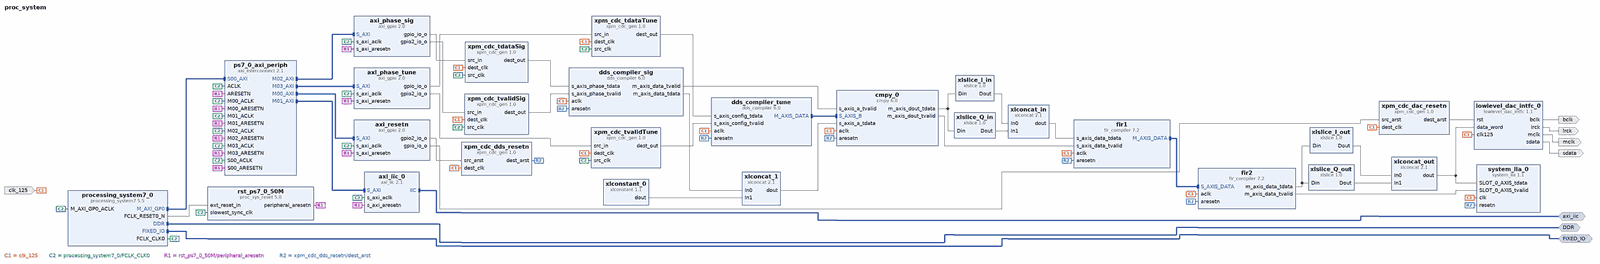
[diagram p0: block diagram of the top level, whole]
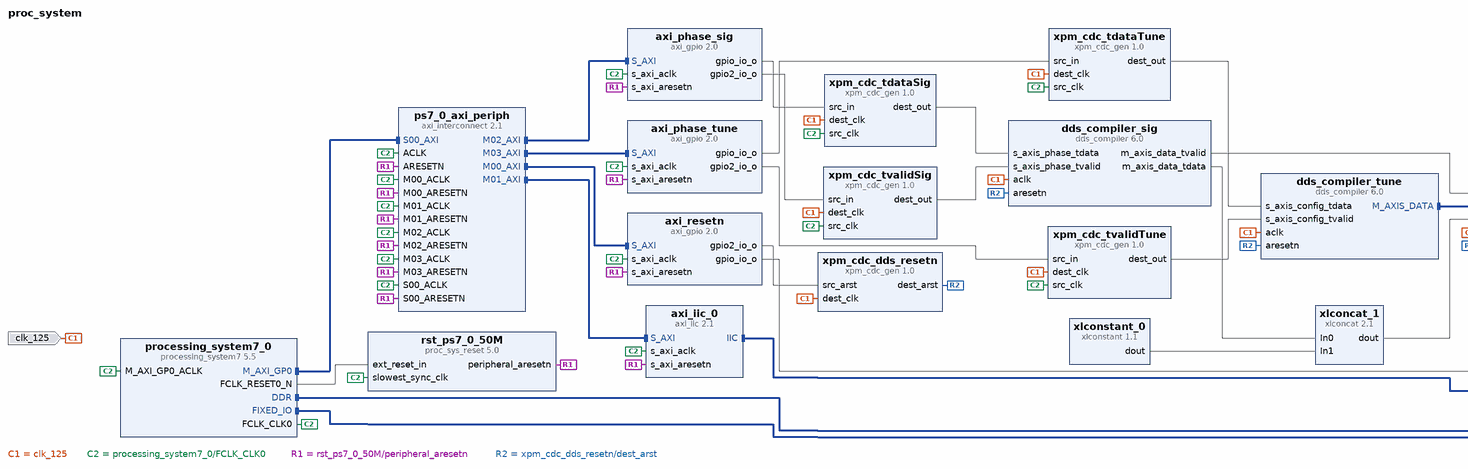
[diagram p1: block diagram of the top level, left part]
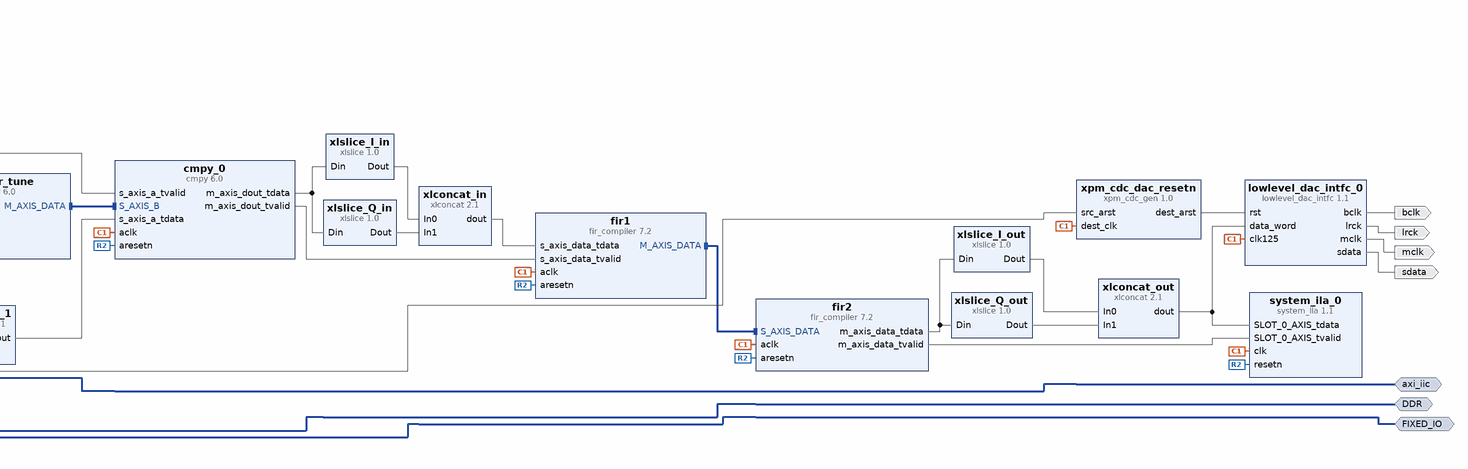
[diagram p2: block diagram of the top level, right part]
# Vivado block design proc_system, xc7z020clg400-1, Vivado 2022.1
create_bd_design proc_system

create_bd_intf_port -mode Master -vlnv xilinx.com:interface:ddrx_rtl:1.0 DDR
create_bd_intf_port -mode Master -vlnv xilinx.com:display_processing_system7:fixedio_rtl:1.0 FIXED_IO
create_bd_intf_port -mode Master -vlnv xilinx.com:interface:iic_rtl:1.0 axi_iic
create_bd_port -dir I -type clk clk_125
set_property -dict {CONFIG.FREQ_HZ 125000000} [get_bd_ports clk_125]
create_bd_port -dir O sdata
create_bd_port -dir O bclk
create_bd_port -dir O lrck
create_bd_port -dir O mclk

create_bd_cell -type ip -vlnv xilinx.com:ip:axi_iic:2.1 axi_iic_0
set_property -dict {CONFIG.IIC_BOARD_INTERFACE hdmi_in_ddc CONFIG.USE_BOARD_FLOW true} [get_bd_cells axi_iic_0]
create_bd_cell -type ip -vlnv xilinx.com:ip:processing_system7:5.5 processing_system7_0
set_property -dict [list \
  CONFIG.PCW_APU_PERIPHERAL_FREQMHZ 667 \
  CONFIG.PCW_ENET0_ENET0_IO {MIO 16 .. 27} \
  CONFIG.PCW_ENET0_GRP_MDIO_ENABLE 1 \
  CONFIG.PCW_ENET0_GRP_MDIO_IO {MIO 52 .. 53} \
  CONFIG.PCW_ENET0_PERIPHERAL_ENABLE 1 \
  CONFIG.PCW_ENET0_RESET_ENABLE 0 \
  CONFIG.PCW_ENET_RESET_ENABLE 1 \
  CONFIG.PCW_ENET_RESET_SELECT {Share reset pin} \
  CONFIG.PCW_FPGA0_PERIPHERAL_FREQMHZ 125 \
  CONFIG.PCW_GPIO_MIO_GPIO_ENABLE 1 \
  CONFIG.PCW_GPIO_MIO_GPIO_IO MIO \
  CONFIG.PCW_I2C_RESET_ENABLE 0 \
  CONFIG.PCW_PRESET_BANK1_VOLTAGE {LVCMOS 1.8V} \
  CONFIG.PCW_QSPI_GRP_FBCLK_ENABLE 1 \
  CONFIG.PCW_QSPI_GRP_FBCLK_IO {MIO 8} \
  CONFIG.PCW_QSPI_GRP_SINGLE_SS_ENABLE 1 \
  CONFIG.PCW_QSPI_GRP_SINGLE_SS_IO {MIO 1 .. 6} \
  CONFIG.PCW_QSPI_PERIPHERAL_ENABLE 1 \
  CONFIG.PCW_QSPI_QSPI_IO {MIO 1 .. 6} \
  CONFIG.PCW_SD0_GRP_CD_ENABLE 1 \
  CONFIG.PCW_SD0_GRP_CD_IO {MIO 47} \
  CONFIG.PCW_SD0_GRP_WP_ENABLE 0 \
  CONFIG.PCW_SD0_PERIPHERAL_ENABLE 1 \
  CONFIG.PCW_SD0_SD0_IO {MIO 40 .. 45} \
  CONFIG.PCW_SDIO_PERIPHERAL_FREQMHZ 50 \
  CONFIG.PCW_SINGLE_QSPI_DATA_MODE x4 \
  CONFIG.PCW_UART1_PERIPHERAL_ENABLE 1 \
  CONFIG.PCW_UART1_UART1_IO {MIO 48 .. 49} \
  CONFIG.PCW_UART_PERIPHERAL_FREQMHZ 100 \
  CONFIG.PCW_UIPARAM_DDR_FREQ_MHZ 533.333333 \
  CONFIG.PCW_UIPARAM_DDR_MEMORY_TYPE {DDR 3 (Low Voltage)} \
  CONFIG.PCW_UIPARAM_DDR_PARTNO {MT41K256M16 RE-125} \
  CONFIG.PCW_UIPARAM_GENERATE_SUMMARY NONE \
  CONFIG.PCW_USB0_PERIPHERAL_ENABLE 1 \
  CONFIG.PCW_USB0_RESET_ENABLE 1 \
  CONFIG.PCW_USB0_RESET_IO {MIO 46} \
  CONFIG.PCW_USB0_USB0_IO {MIO 28 .. 39} \
  CONFIG.PCW_USB_RESET_ENABLE 1 \
  CONFIG.PCW_USB_RESET_SELECT {Share reset pin} \
] [get_bd_cells processing_system7_0]
# 296 more settings of processing_system7_0 are not shown: defaults, MIO pin electricals, DDR timing, and values the tool derives
create_bd_cell -type ip -vlnv xilinx.com:ip:axi_interconnect:2.1 ps7_0_axi_periph
set_property -dict {CONFIG.NUM_MI 4} [get_bd_cells ps7_0_axi_periph]
create_bd_cell -type ip -vlnv xilinx.com:ip:axi_gpio:2.0 axi_resetn
set_property -dict [list \
  CONFIG.C_ALL_INPUTS 0 \
  CONFIG.C_ALL_OUTPUTS 1 \
  CONFIG.C_ALL_OUTPUTS_2 1 \
  CONFIG.C_DOUT_DEFAULT_2 0x00000001 \
  CONFIG.C_GPIO2_WIDTH 1 \
  CONFIG.C_GPIO_WIDTH 1 \
  CONFIG.C_IS_DUAL 1 \
  CONFIG.GPIO2_BOARD_INTERFACE Custom \
  CONFIG.GPIO_BOARD_INTERFACE Custom \
  CONFIG.USE_BOARD_FLOW true \
] [get_bd_cells axi_resetn]
create_bd_cell -type ip -vlnv xilinx.com:ip:proc_sys_reset:5.0 rst_ps7_0_50M
create_bd_cell -type ip -vlnv xilinx.com:ip:dds_compiler:6.0 dds_compiler_sig
set_property -dict [list \
  CONFIG.Amplitude_Mode Unit_Circle \
  CONFIG.DATA_Has_TLAST Not_Required \
  CONFIG.DDS_Clock_Rate 125 \
  CONFIG.Frequency_Resolution 0.4 \
  CONFIG.Has_ARESETn true \
  CONFIG.Has_Phase_Out false \
  CONFIG.Latency 8 \
  CONFIG.M_DATA_Has_TUSER Not_Required \
  CONFIG.Noise_Shaping Taylor_Series_Corrected \
  CONFIG.Output_Frequency1 0 \
  CONFIG.Output_Selection Cosine \
  CONFIG.Output_Width 16 \
  CONFIG.PINC1 0 \
  CONFIG.Parameter_Entry Hardware_Parameters \
  CONFIG.Phase_Increment Streaming \
  CONFIG.Phase_Width 27 \
  CONFIG.S_PHASE_Has_TUSER Not_Required \
] [get_bd_cells dds_compiler_sig]
create_bd_cell -type ip -vlnv xilinx.com:ip:axi_gpio:2.0 axi_phase_sig
set_property -dict [list \
  CONFIG.C_ALL_INPUTS_2 0 \
  CONFIG.C_ALL_OUTPUTS 1 \
  CONFIG.C_ALL_OUTPUTS_2 1 \
  CONFIG.C_GPIO2_WIDTH 1 \
  CONFIG.C_IS_DUAL 1 \
  CONFIG.GPIO2_BOARD_INTERFACE Custom \
] [get_bd_cells axi_phase_sig]
create_bd_cell -type ip -vlnv xilinx.com:ip:system_ila:1.1 system_ila_0
set_property -dict [list \
  CONFIG.ALL_PROBE_SAME_MU_CNT 2 \
  CONFIG.C_DATA_DEPTH 2048 \
  CONFIG.C_EN_STRG_QUAL 1 \
  CONFIG.C_NUM_MONITOR_SLOTS 1 \
  CONFIG.C_PROBE0_MU_CNT 2 \
  CONFIG.C_SLOT 0 \
  CONFIG.C_SLOT_0_APC_EN 0 \
  CONFIG.C_SLOT_0_INTF_TYPE xilinx.com:interface:axis_rtl:1.0 \
  CONFIG.C_SLOT_1_AXIS_TDATA_WIDTH 16 \
  CONFIG.C_SLOT_1_INTF_TYPE xilinx.com:interface:axis_rtl:1.0 \
] [get_bd_cells system_ila_0]
create_bd_cell -type ip -vlnv xilinx.com:ip:xpm_cdc_gen:1.0 xpm_cdc_tvalidSig
set_property -dict {CONFIG.WIDTH 1} [get_bd_cells xpm_cdc_tvalidSig]
create_bd_cell -type ip -vlnv xilinx.com:ip:xpm_cdc_gen:1.0 xpm_cdc_dac_resetn
set_property -dict {CONFIG.CDC_TYPE xpm_cdc_async_rst CONFIG.WIDTH 1} [get_bd_cells xpm_cdc_dac_resetn]
create_bd_cell -type ip -vlnv xilinx.com:ip:xpm_cdc_gen:1.0 xpm_cdc_dds_resetn
set_property -dict {CONFIG.CDC_TYPE xpm_cdc_async_rst} [get_bd_cells xpm_cdc_dds_resetn]
create_bd_cell -type ip -vlnv xilinx.com:ip:xpm_cdc_gen:1.0 xpm_cdc_tdataSig
set_property -dict {CONFIG.WIDTH 32} [get_bd_cells xpm_cdc_tdataSig]
create_bd_cell -type ip -vlnv xilinx.com:ip:fir_compiler:7.2 fir1
set_property -dict [list \
  CONFIG.BestPrecision false \
  CONFIG.Clock_Frequency 125 \
  CONFIG.CoefficientSource COE_File \
  CONFIG.Coefficient_File ../../../../../../../../../Module4/Lab4_analysis/filter1.coe \
  CONFIG.Coefficient_Fractional_Bits 15 \
  CONFIG.Coefficient_Sets 1 \
  CONFIG.Coefficient_Sign Signed \
  CONFIG.Coefficient_Structure Inferred \
  CONFIG.Coefficient_Width 18 \
  CONFIG.ColumnConfig 3 \
  CONFIG.Decimation_Rate 40 \
  CONFIG.Filter_Architecture Systolic_Multiply_Accumulate \
  CONFIG.Filter_Type Decimation \
  CONFIG.Has_ARESETn true \
  CONFIG.Interpolation_Rate 1 \
  CONFIG.Number_Channels 1 \
  CONFIG.Number_Paths 2 \
  CONFIG.Output_Rounding_Mode Truncate_LSBs \
  CONFIG.Output_Width 17 \
  CONFIG.Quantization Quantize_Only \
  CONFIG.RateSpecification Frequency_Specification \
  CONFIG.Rate_Change_Type Integer \
  CONFIG.Sample_Frequency 125 \
  CONFIG.Zero_Pack_Factor 1 \
] [get_bd_cells fir1]
create_bd_cell -type ip -vlnv xilinx.com:ip:fir_compiler:7.2 fir2
set_property -dict [list \
  CONFIG.Clock_Frequency 125 \
  CONFIG.CoefficientSource COE_File \
  CONFIG.Coefficient_File ../../../../../../../../../Module4/Lab4_analysis/filter2.coe \
  CONFIG.Coefficient_Fractional_Bits 15 \
  CONFIG.Coefficient_Sets 1 \
  CONFIG.Coefficient_Sign Signed \
  CONFIG.Coefficient_Structure Inferred \
  CONFIG.Coefficient_Width 18 \
  CONFIG.Decimation_Rate 64 \
  CONFIG.Filter_Architecture Systolic_Multiply_Accumulate \
  CONFIG.Filter_Type Decimation \
  CONFIG.Has_ARESETn true \
  CONFIG.Interpolation_Rate 1 \
  CONFIG.Number_Channels 1 \
  CONFIG.Number_Paths 2 \
  CONFIG.Output_Rounding_Mode Truncate_LSBs \
  CONFIG.Output_Width 18 \
  CONFIG.Quantization Quantize_Only \
  CONFIG.RateSpecification Frequency_Specification \
  CONFIG.Sample_Frequency 3.125 \
  CONFIG.Zero_Pack_Factor 1 \
] [get_bd_cells fir2]
create_bd_cell -type ip -vlnv xilinx.com:ip:xlslice:1.0 xlslice_I_out
set_property -dict {CONFIG.DIN_FROM 15 CONFIG.DIN_WIDTH 48 CONFIG.DOUT_WIDTH 16} [get_bd_cells xlslice_I_out]
create_bd_cell -type ip -vlnv xilinx.com:ip:dds_compiler:6.0 dds_compiler_tune
set_property -dict [list \
  CONFIG.Amplitude_Mode Unit_Circle \
  CONFIG.DATA_Has_TLAST Not_Required \
  CONFIG.DDS_Clock_Rate 125 \
  CONFIG.Has_ARESETn true \
  CONFIG.Has_Phase_Out false \
  CONFIG.Latency 8 \
  CONFIG.M_DATA_Has_TUSER Not_Required \
  CONFIG.Noise_Shaping Taylor_Series_Corrected \
  CONFIG.Output_Frequency1 0 \
  CONFIG.Output_Width 16 \
  CONFIG.Parameter_Entry Hardware_Parameters \
  CONFIG.Phase_Increment Programmable \
  CONFIG.Phase_Width 27 \
  CONFIG.Phase_offset None \
  CONFIG.S_PHASE_Has_TUSER Not_Required \
] [get_bd_cells dds_compiler_tune]
create_bd_cell -type ip -vlnv xilinx.com:ip:axi_gpio:2.0 axi_phase_tune
set_property -dict [list \
  CONFIG.C_ALL_INPUTS 0 \
  CONFIG.C_ALL_INPUTS_2 0 \
  CONFIG.C_ALL_OUTPUTS 1 \
  CONFIG.C_ALL_OUTPUTS_2 1 \
  CONFIG.C_GPIO2_WIDTH 1 \
  CONFIG.C_GPIO_WIDTH 32 \
  CONFIG.C_IS_DUAL 1 \
  CONFIG.GPIO2_BOARD_INTERFACE Custom \
  CONFIG.GPIO_BOARD_INTERFACE Custom \
  CONFIG.USE_BOARD_FLOW true \
] [get_bd_cells axi_phase_tune]
create_bd_cell -type ip -vlnv xilinx.com:ip:xpm_cdc_gen:1.0 xpm_cdc_tdataTune
set_property -dict {CONFIG.WIDTH 32} [get_bd_cells xpm_cdc_tdataTune]
create_bd_cell -type ip -vlnv xilinx.com:ip:xpm_cdc_gen:1.0 xpm_cdc_tvalidTune
set_property -dict {CONFIG.WIDTH 1} [get_bd_cells xpm_cdc_tvalidTune]
create_bd_cell -type ip -vlnv jhuapl.edu:user:lowlevel_dac_intfc:1.1 lowlevel_dac_intfc_0
create_bd_cell -type ip -vlnv xilinx.com:ip:cmpy:6.0 cmpy_0
set_property -dict [list \
  CONFIG.APortWidth 16 \
  CONFIG.ARESETN true \
  CONFIG.BPortWidth 16 \
  CONFIG.MinimumLatency 6 \
  CONFIG.OutputWidth 19 \
  CONFIG.RoundMode Truncate \
] [get_bd_cells cmpy_0]
create_bd_cell -type ip -vlnv xilinx.com:ip:xlslice:1.0 xlslice_Q_out
set_property -dict {CONFIG.DIN_FROM 39 CONFIG.DIN_TO 24 CONFIG.DIN_WIDTH 48 CONFIG.DOUT_WIDTH 16} [get_bd_cells xlslice_Q_out]
create_bd_cell -type ip -vlnv xilinx.com:ip:xlconcat:2.1 xlconcat_out
create_bd_cell -type ip -vlnv xilinx.com:ip:xlconcat:2.1 xlconcat_1
create_bd_cell -type ip -vlnv xilinx.com:ip:xlconstant:1.1 xlconstant_0
set_property -dict {CONFIG.CONST_VAL 0 CONFIG.CONST_WIDTH 16} [get_bd_cells xlconstant_0]
create_bd_cell -type ip -vlnv xilinx.com:ip:xlslice:1.0 xlslice_I_in
set_property -dict {CONFIG.DIN_FROM 15 CONFIG.DIN_WIDTH 48 CONFIG.DOUT_WIDTH 16} [get_bd_cells xlslice_I_in]
create_bd_cell -type ip -vlnv xilinx.com:ip:xlslice:1.0 xlslice_Q_in
set_property -dict {CONFIG.DIN_FROM 39 CONFIG.DIN_TO 24 CONFIG.DIN_WIDTH 48 CONFIG.DOUT_WIDTH 16} [get_bd_cells xlslice_Q_in]
create_bd_cell -type ip -vlnv xilinx.com:ip:xlconcat:2.1 xlconcat_in

# ---- connections ----

connect_bd_intf_net [get_bd_intf_ports axi_iic] [get_bd_intf_pins axi_iic_0/IIC]
connect_bd_intf_net [get_bd_intf_pins dds_compiler_tune/M_AXIS_DATA] [get_bd_intf_pins cmpy_0/S_AXIS_B]
connect_bd_intf_net [get_bd_intf_pins fir1/M_AXIS_DATA] [get_bd_intf_pins fir2/S_AXIS_DATA]
connect_bd_intf_net [get_bd_intf_ports DDR] [get_bd_intf_pins processing_system7_0/DDR]
connect_bd_intf_net [get_bd_intf_ports FIXED_IO] [get_bd_intf_pins processing_system7_0/FIXED_IO]
connect_bd_intf_net [get_bd_intf_pins processing_system7_0/M_AXI_GP0] [get_bd_intf_pins ps7_0_axi_periph/S00_AXI]
connect_bd_intf_net [get_bd_intf_pins ps7_0_axi_periph/M00_AXI] [get_bd_intf_pins axi_resetn/S_AXI]
connect_bd_intf_net [get_bd_intf_pins axi_iic_0/S_AXI] [get_bd_intf_pins ps7_0_axi_periph/M01_AXI]
connect_bd_intf_net [get_bd_intf_pins ps7_0_axi_periph/M02_AXI] [get_bd_intf_pins axi_phase_sig/S_AXI]
connect_bd_intf_net [get_bd_intf_pins ps7_0_axi_periph/M03_AXI] [get_bd_intf_pins axi_phase_tune/S_AXI]
connect_bd_net -net axi_phaseTune_gpio2_io_o [get_bd_pins axi_phase_tune/gpio2_io_o] [get_bd_pins xpm_cdc_tvalidTune/src_in]
connect_bd_net -net axi_phaseTune_gpio_io_o [get_bd_pins axi_phase_tune/gpio_io_o] [get_bd_pins xpm_cdc_tdataTune/src_in]
connect_bd_net -net axi_phase_gpio2_io_o [get_bd_pins axi_phase_sig/gpio2_io_o] [get_bd_pins xpm_cdc_tvalidSig/src_in]
connect_bd_net -net axi_phase_gpio_io_o [get_bd_pins axi_phase_sig/gpio_io_o] [get_bd_pins xpm_cdc_tdataSig/src_in]
connect_bd_net [get_bd_pins axi_resetn/gpio2_io_o] [get_bd_pins xpm_cdc_dds_resetn/src_arst]
connect_bd_net [get_bd_pins axi_resetn/gpio_io_o] [get_bd_pins xpm_cdc_dac_resetn/src_arst]
connect_bd_net [get_bd_ports clk_125] \
  [get_bd_pins dds_compiler_sig/aclk] [get_bd_pins system_ila_0/clk] [get_bd_pins xpm_cdc_tvalidSig/dest_clk] \
  [get_bd_pins xpm_cdc_dac_resetn/dest_clk] [get_bd_pins xpm_cdc_dds_resetn/dest_clk] [get_bd_pins xpm_cdc_tdataSig/dest_clk] \
  [get_bd_pins fir1/aclk] [get_bd_pins fir2/aclk] [get_bd_pins xpm_cdc_tvalidTune/dest_clk] \
  [get_bd_pins xpm_cdc_tdataTune/dest_clk] [get_bd_pins dds_compiler_tune/aclk] [get_bd_pins cmpy_0/aclk] \
  [get_bd_pins lowlevel_dac_intfc_0/clk125]
connect_bd_net [get_bd_pins cmpy_0/m_axis_dout_tdata] [get_bd_pins xlslice_I_in/Din] [get_bd_pins xlslice_Q_in/Din]
connect_bd_net [get_bd_pins cmpy_0/m_axis_dout_tvalid] [get_bd_pins fir1/s_axis_data_tvalid]
connect_bd_net [get_bd_pins dds_compiler_sig/m_axis_data_tdata] [get_bd_pins xlconcat_1/In0]
connect_bd_net [get_bd_pins dds_compiler_sig/m_axis_data_tvalid] [get_bd_pins cmpy_0/s_axis_a_tvalid]
connect_bd_net [get_bd_pins fir2/m_axis_data_tdata] [get_bd_pins xlslice_I_out/Din] [get_bd_pins xlslice_Q_out/Din]
connect_bd_net [get_bd_pins fir2/m_axis_data_tvalid] [get_bd_pins system_ila_0/SLOT_0_AXIS_tvalid]
connect_bd_net [get_bd_pins lowlevel_dac_intfc_0/bclk] [get_bd_ports bclk]
connect_bd_net [get_bd_pins lowlevel_dac_intfc_0/lrck] [get_bd_ports lrck]
connect_bd_net [get_bd_pins lowlevel_dac_intfc_0/mclk] [get_bd_ports mclk]
connect_bd_net [get_bd_pins lowlevel_dac_intfc_0/sdata] [get_bd_ports sdata]
connect_bd_net [get_bd_pins processing_system7_0/FCLK_CLK0] \
  [get_bd_pins axi_iic_0/s_axi_aclk] [get_bd_pins processing_system7_0/M_AXI_GP0_ACLK] [get_bd_pins ps7_0_axi_periph/ACLK] \
  [get_bd_pins ps7_0_axi_periph/M00_ACLK] [get_bd_pins ps7_0_axi_periph/M01_ACLK] [get_bd_pins ps7_0_axi_periph/M02_ACLK] \
  [get_bd_pins ps7_0_axi_periph/S00_ACLK] [get_bd_pins axi_resetn/s_axi_aclk] [get_bd_pins rst_ps7_0_50M/slowest_sync_clk] \
  [get_bd_pins axi_phase_sig/s_axi_aclk] [get_bd_pins xpm_cdc_tvalidSig/src_clk] [get_bd_pins xpm_cdc_tdataSig/src_clk] \
  [get_bd_pins axi_phase_tune/s_axi_aclk] [get_bd_pins xpm_cdc_tdataTune/src_clk] [get_bd_pins xpm_cdc_tvalidTune/src_clk] \
  [get_bd_pins ps7_0_axi_periph/M03_ACLK]
connect_bd_net [get_bd_pins processing_system7_0/FCLK_RESET0_N] [get_bd_pins rst_ps7_0_50M/ext_reset_in]
connect_bd_net [get_bd_pins rst_ps7_0_50M/peripheral_aresetn] \
  [get_bd_pins axi_iic_0/s_axi_aresetn] [get_bd_pins ps7_0_axi_periph/ARESETN] [get_bd_pins ps7_0_axi_periph/M00_ARESETN] \
  [get_bd_pins ps7_0_axi_periph/M01_ARESETN] [get_bd_pins ps7_0_axi_periph/M02_ARESETN] \
  [get_bd_pins ps7_0_axi_periph/S00_ARESETN] [get_bd_pins axi_resetn/s_axi_aresetn] [get_bd_pins axi_phase_sig/s_axi_aresetn] \
  [get_bd_pins axi_phase_tune/s_axi_aresetn] [get_bd_pins ps7_0_axi_periph/M03_ARESETN]
connect_bd_net -net xlconcat_0_dout [get_bd_pins xlconcat_out/dout] \
  [get_bd_pins lowlevel_dac_intfc_0/data_word] [get_bd_pins system_ila_0/SLOT_0_AXIS_tdata]
connect_bd_net [get_bd_pins xlconcat_1/dout] [get_bd_pins cmpy_0/s_axis_a_tdata]
connect_bd_net -net xlconcat_2_dout [get_bd_pins xlconcat_in/dout] [get_bd_pins fir1/s_axis_data_tdata]
connect_bd_net [get_bd_pins xlconstant_0/dout] [get_bd_pins xlconcat_1/In1]
connect_bd_net -net xlslice_0_Dout [get_bd_pins xlslice_I_out/Dout] [get_bd_pins xlconcat_out/In0]
connect_bd_net -net xlslice_1_Dout [get_bd_pins xlslice_Q_out/Dout] [get_bd_pins xlconcat_out/In1]
connect_bd_net [get_bd_pins xlslice_I_in/Dout] [get_bd_pins xlconcat_in/In0]
connect_bd_net [get_bd_pins xlslice_Q_in/Dout] [get_bd_pins xlconcat_in/In1]
connect_bd_net [get_bd_pins xpm_cdc_dac_resetn/dest_arst] [get_bd_pins lowlevel_dac_intfc_0/rst]
connect_bd_net -net xpm_cdc_gen_0_dest_arst [get_bd_pins xpm_cdc_dds_resetn/dest_arst] \
  [get_bd_pins dds_compiler_sig/aresetn] [get_bd_pins system_ila_0/resetn] [get_bd_pins fir1/aresetn] \
  [get_bd_pins fir2/aresetn] [get_bd_pins dds_compiler_tune/aresetn] [get_bd_pins cmpy_0/aresetn]
connect_bd_net [get_bd_pins xpm_cdc_tdataTune/dest_out] [get_bd_pins dds_compiler_tune/s_axis_config_tdata]
connect_bd_net -net xpm_cdc_tdata_dest_out [get_bd_pins xpm_cdc_tdataSig/dest_out] [get_bd_pins dds_compiler_sig/s_axis_phase_tdata]
connect_bd_net [get_bd_pins xpm_cdc_tvalidTune/dest_out] [get_bd_pins dds_compiler_tune/s_axis_config_tvalid]
connect_bd_net -net xpm_cdc_tvalid_dest_out [get_bd_pins xpm_cdc_tvalidSig/dest_out] [get_bd_pins dds_compiler_sig/s_axis_phase_tvalid]

# ---- address map ----
assign_bd_address -offset 0x41200000 -range 64K -target_address_space [get_bd_addr_spaces processing_system7_0/Data] [get_bd_addr_segs axi_resetn/S_AXI/Reg]
assign_bd_address -offset 0x41210000 -range 64K -target_address_space [get_bd_addr_spaces processing_system7_0/Data] [get_bd_addr_segs axi_phase_sig/S_AXI/Reg]
assign_bd_address -offset 0x41220000 -range 64K -target_address_space [get_bd_addr_spaces processing_system7_0/Data] [get_bd_addr_segs axi_phase_tune/S_AXI/Reg]
assign_bd_address -offset 0x41600000 -range 64K -target_address_space [get_bd_addr_spaces processing_system7_0/Data] [get_bd_addr_segs axi_iic_0/S_AXI/Reg]

validate_bd_design
save_bd_design
